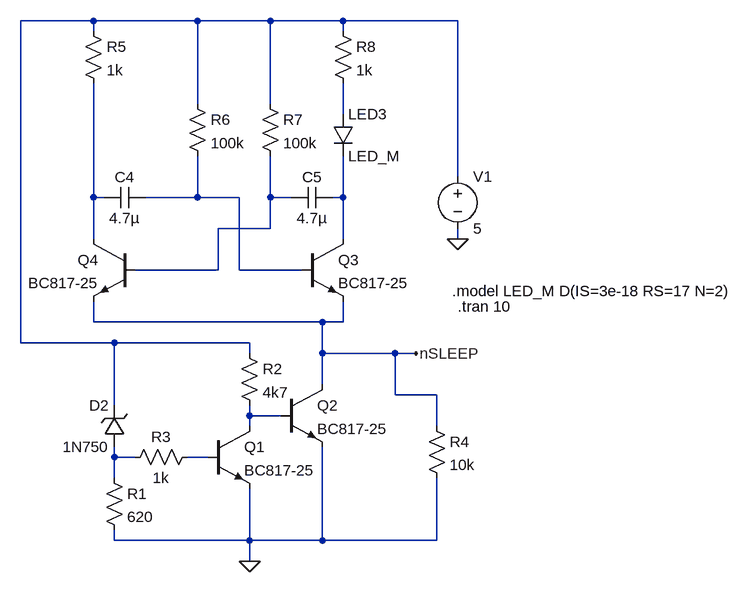
[diagram p0: schematic Low Battery Indicator.asc]
Low Battery Indicator.asc, the LTspice schematic file:
Version 4
SHEET 1 1788 680
WIRE -752 -576 -864 -576
WIRE -592 -576 -752 -576
WIRE -480 -576 -592 -576
WIRE -368 -576 -480 -576
WIRE -192 -576 -368 -576
WIRE -752 -560 -752 -576
WIRE -368 -560 -368 -576
WIRE -592 -448 -592 -576
WIRE -480 -448 -480 -576
WIRE -368 -432 -368 -480
WIRE -192 -336 -192 -576
WIRE -752 -304 -752 -480
WIRE -736 -304 -752 -304
WIRE -592 -304 -592 -368
WIRE -592 -304 -672 -304
WIRE -528 -304 -592 -304
WIRE -480 -304 -480 -368
WIRE -448 -304 -480 -304
WIRE -368 -304 -368 -368
WIRE -368 -304 -384 -304
WIRE -480 -256 -480 -304
WIRE -480 -256 -560 -256
WIRE -752 -240 -752 -304
WIRE -368 -240 -368 -304
WIRE -192 -240 -192 -256
WIRE -560 -192 -560 -256
WIRE -560 -192 -688 -192
WIRE -528 -192 -528 -304
WIRE -432 -192 -528 -192
WIRE -752 -112 -752 -144
WIRE -400 -112 -752 -112
WIRE -368 -112 -368 -144
WIRE -368 -112 -400 -112
WIRE -864 -80 -864 -576
WIRE -720 -80 -864 -80
WIRE -512 -80 -720 -80
WIRE -512 -64 -512 -80
WIRE -400 -64 -400 -112
WIRE -288 -64 -400 -64
WIRE -256 -64 -288 -64
WIRE -400 -16 -400 -64
WIRE -288 0 -288 -64
WIRE -224 0 -288 0
WIRE -720 16 -720 -80
WIRE -512 32 -512 16
WIRE -464 32 -512 32
WIRE -512 48 -512 32
WIRE -224 48 -224 0
WIRE -720 96 -720 80
WIRE -688 96 -720 96
WIRE -576 96 -608 96
WIRE -720 128 -720 96
WIRE -720 224 -720 208
WIRE -512 224 -512 144
WIRE -512 224 -720 224
WIRE -400 224 -400 80
WIRE -400 224 -512 224
WIRE -224 224 -224 128
WIRE -224 224 -400 224
WIRE -512 256 -512 224
FLAG -192 -240 0
FLAG -512 256 0
FLAG -256 -64 nSLEEP
SYMBOL voltage -192 -352 R0
WINDOW 123 0 0 Left 0
WINDOW 39 0 0 Left 0
SYMATTR InstName V1
SYMATTR Value 5
SYMBOL npn -432 -240 R0
SYMATTR InstName Q3
SYMATTR Value BC817-25
SYMBOL npn -688 -240 M0
SYMATTR InstName Q4
SYMATTR Value BC817-25
SYMBOL cap -672 -320 R90
WINDOW 0 0 32 VBottom 2
WINDOW 3 32 32 VTop 2
SYMATTR InstName C4
SYMATTR Value 4.7µ
SYMBOL cap -384 -320 R90
WINDOW 0 0 32 VBottom 2
WINDOW 3 32 32 VTop 2
SYMATTR InstName C5
SYMATTR Value 4.7µ
SYMBOL res -768 -576 R0
SYMATTR InstName R5
SYMATTR Value 1k
SYMBOL res -608 -464 R0
SYMATTR InstName R6
SYMATTR Value 100k
SYMBOL res -496 -464 R0
SYMATTR InstName R7
SYMATTR Value 100k
SYMBOL diode -384 -432 R0
SYMATTR InstName LED3
SYMATTR Value LED_M
SYMBOL res -384 -576 R0
SYMATTR InstName R8
SYMATTR Value 1k
SYMBOL zener -704 80 R180
WINDOW 0 24 64 Left 2
WINDOW 3 24 0 Left 2
SYMATTR InstName D2
SYMATTR Value 1N750
SYMATTR Description Diode
SYMATTR Type diode
SYMBOL npn -576 48 R0
SYMATTR InstName Q1
SYMATTR Value BC817-25
SYMBOL res -736 112 R0
SYMATTR InstName R1
SYMATTR Value 620
SYMBOL res -528 -80 R0
SYMATTR InstName R2
SYMATTR Value 4k7
SYMBOL npn -464 -16 R0
SYMATTR InstName Q2
SYMATTR Value BC817-25
SYMBOL res -592 80 R90
WINDOW 0 0 56 VBottom 2
WINDOW 3 32 56 VTop 2
SYMATTR InstName R3
SYMATTR Value 1k
SYMBOL res -240 32 R0
SYMATTR InstName R4
SYMATTR Value 10k
TEXT -192 -136 Left 2 !.tran 10
TEXT -200 -160 Left 2 !.model LED_M D(IS=3e-18 RS=17 N=2)

The netlist it stands for:
* Low Battery Indicator.asc
V1 N001 0 5
Q3 N006 N004 nSLEEP 0 BC817-25
Q4 N003 N005 nSLEEP 0 BC817-25
C4 N004 N003 4.7µ
C5 N006 N005 4.7µ
R5 N001 N003 1k
R6 N001 N004 100k
R7 N001 N005 100k
D§LED3 N002 N006 LED_M
R8 N001 N002 1k
D2 N008 N001 1N750
Q1 N007 N009 0 0 BC817-25
R1 N008 0 620
R2 N001 N007 4k7
Q2 nSLEEP N007 0 0 BC817-25
R3 N009 N008 1k
R4 nSLEEP 0 10k
.model D D
.lib standard.dio
.model NPN NPN
.model PNP PNP
.lib standard.bjt
.tran 10
.model LED_M D(IS=3e-18 RS=17 N=2)
.backanno
.end